# Altium schematic sheet Pico.SchDoc: Mass Storage
size A; SheetNumber: 4; SheetTotal: 7
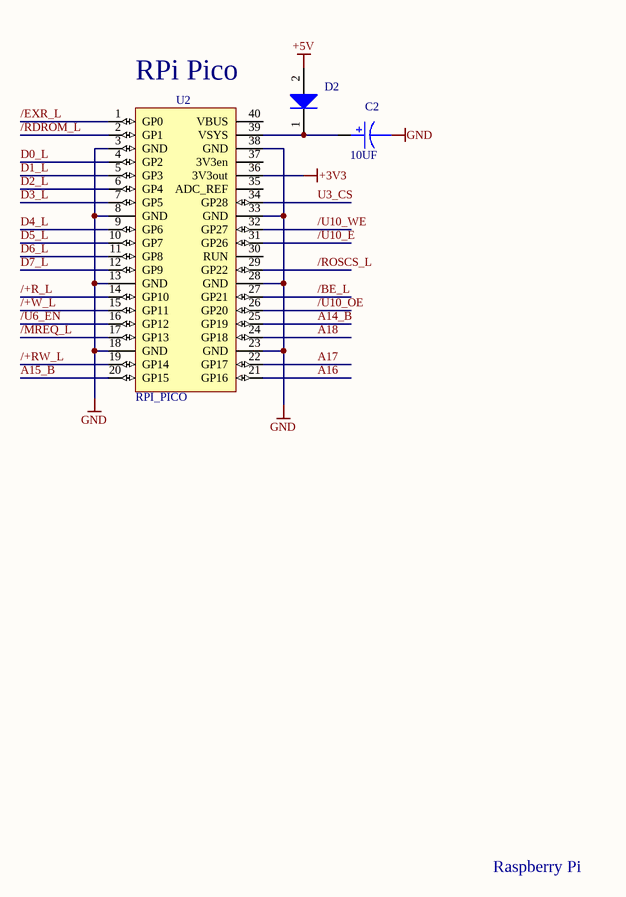
[diagram p0: Pico.SchDoc]

## Parts
C2  10UF  [CAP10EL]
D2  SB260_R2_00001  [DO-15]  (value not drawn)
U2  RPI_PICO  [RPIPICO]

## Nets
+3V3: U2.36(3V3out)
+5V: D2.2(A)
GND: C2.2 U2.3(GND) U2.8(GND) U2.13(GND) U2.18(GND) U2.23(GND) U2.28(GND) U2.33(GND) U2.38(GND)
/+R_L: U2.14(GP10)
/+RW_L: U2.19(GP14)
/+W_L: U2.15(GP11)
/BE_L: U2.27(GP21)
/EXR_L: U2.1(GP0)
/MREQ_L: U2.17(GP13)
/RDROM_L: U2.2(GP1)
/ROSCS_L: U2.29(GP22)
/U6_EN: U2.16(GP12)
/U10_E: U2.31(GP26)
/U10_OE: U2.26(GP20)
/U10_WE: U2.32(GP27)
A14_B: U2.25(GP19)
A15_B: U2.20(GP15)
A16: U2.21(GP16)
A17: U2.22(GP17)
A18: U2.24(GP18)
D0_L: U2.4(GP2)
D1_L: U2.5(GP3)
D2_L: U2.6(GP4)
D3_L: U2.7(GP5)
D4_L: U2.9(GP6)
D5_L: U2.10(GP7)
D6_L: U2.11(GP8)
D7_L: U2.12(GP9)
U3_CS: U2.34(GP28)
NetC2_1: C2.1 D2.1 U2.39(VSYS)

Not connected (* = marked no-connect by the designer): U2 30(RUN) 35(ADC_REF) 37(3V3en) 40(VBUS)

## Notes on the sheet
- RPi Pico
- Raspberry Pi

## Library data of the parts
C2 = 10UF: CAP ALUM 10UF 20% 16V RADIAL; MFG: Panasonic; MFG PN: ECE-A1CKA100; DK PN: P807-ND
D2 = SB260_R2_00001: DIODE SCHOTTKY 60V 2A DO15; DK PN: 3757-SB260_R2_00001CT-ND; MFG: Panjit; MFG PN: SB260_R2_00001; FOOTPRINT: DO15; Populate: *
U2 = RPI_PICO: RASPBERRY PI PICO RP2040 BOARD; MFG PN: SC0915; DK PN: 2648-SC0915CT-ND; MFG: Raspberry Pi; Populate: *